# Altium project beaglebone_cape_board.PrjPcb
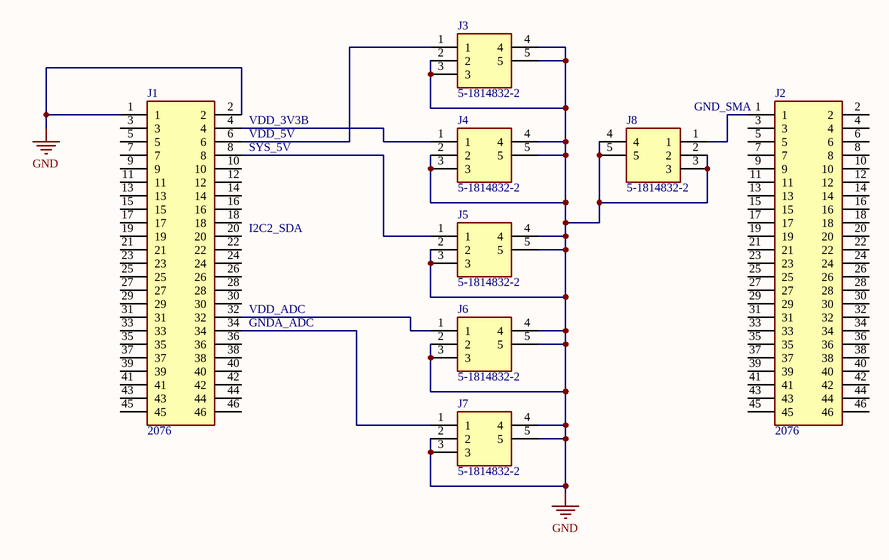
[diagram p0: 001-0002_beaglebone_cape_board.SchDoc]
1 sheet, 8 parts. Net scope: global (net labels, ports and power ports of the same name join across sheets).
Board file: 001-0002_beaglebone_cape_board.PcbDoc

## Sheet 001-0002_beaglebone_cape_board.SchDoc: Beaglebone Cape Board
size A3; Author: HILT; SheetNumber: 1; SheetTotal: 1; ProjectTitle: 001-0002

### Parts
J1  2076  [HDRV46W64P254_2X23_5842X500X874P]
J2  2076  [HDRV46W64P254_2X23_5842X500X874P]
J3  5-1814832-2  [5-1814832-2]
J4  5-1814832-2  [5-1814832-2]
J5  5-1814832-2  [5-1814832-2]
J6  5-1814832-2  [5-1814832-2]
J7  5-1814832-2  [5-1814832-2]
J8  5-1814832-2  [5-1814832-2]

### Nets
GND: J1.1 J1.2 J3.2 J3.3 J3.4 J3.5 J4.2 J4.3 J4.4 J4.5 J5.2 J5.3 J5.4 J5.5 J6.2 J6.3 J6.4 J6.5 J7.2 J7.3 J7.4 J7.5 J8.2 J8.3 J8.4 J8.5
NetJ1_4: J1.4 J4.1
NetJ1_6: J1.6 J3.1
NetJ1_8: J1.8 J5.1
NetJ1_32: J1.32 J6.1
NetJ1_34: J1.34 J7.1
NetJ2_1: J2.1 J8.1

Not connected (* = marked no-connect by the designer): J1 3 5 7 9 10 11 12 13 14 15 16 17 18 19 20 21 22 23 24 25 26 27 28 29 30 31 33 35 36 37 38 39 40 41 42 43 44 45 46; J2 2 3 4 5 6 7 8 9 10 11 12 13 14 15 16 17 18 19 20 21 22 23 24 25 26 27 28 29 30 31 32 33 34 35 36 37 38 39 40 41 42 43 44 45 46

### Notes on the sheet
- (near J1) VDD_3V3B
- GND_SMA
- (near J1) VDD_5V
- (near J1) SYS_5V
- (near J1) I2C2_SDA
- (near J1) VDD_ADC
- (near J1) GNDA_ADC
- Title:
- Author:
- Approved:
- Size:
- Date:
- Git Hash:
- A3
- Prj:
- SW Version:
- Variant:
- Edited:
- File:

### Library data of the parts
J1 J2 = 2076: Adafruit Accessories 2x23 Male Headers for BeagleBone Black - Two Pack; Geometry.Height: 8.74mm; Mouser Part Number: 485-2076; Mouser Price/Stock: https://www.mouser.co.uk/ProductDetail/Adafruit/2076?qs=GURawfaeGuBAvD7rncVFUg%3D%3D; Manufacturer_Name: Adafruit; Manufacturer_Part_Number: 2076; Datasheet Link: https://cdn-shop.adafruit.com/datasheets/16188.pdf
J3-J8 = 5-1814832-2: SMA Connector Jack, Female Socket 50 Ohms Through Hole Solder; Manufacturer_Name: TE Connectivity; Geometry.Height: 9.5mm; Mouser Part Number: 571-5-1814832-2; Mouser Price/Stock: https://www.mouser.co.uk/ProductDetail/TE-Connectivity/5-1814832-2?qs=Cb2nCFKsA8rPOrkEMAAQ4A%3D%3D; Manufacturer_Part_Number: 5-1814832-2; Datasheet Link: https://www.te.com/commerce/DocumentDelivery/DDEController?Action=srchrtrv&DocNm=1-1773725-8_RF_COAX_QRG&DocType=Data%20Sheet&DocLang=English&PartCntxt=5-1814832-2&DocFormat=pdf